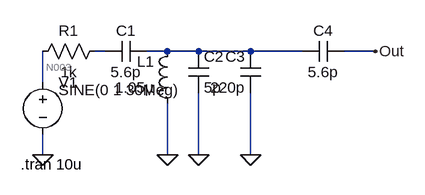
[diagram p0: schematic 10MHz Filter.asc]
10MHz Filter.asc, the LTspice schematic file:
Version 4
SHEET 1 880 680
WIRE 64 192 48 192
WIRE 160 192 128 192
WIRE 208 192 160 192
WIRE 288 192 208 192
WIRE 368 192 288 192
WIRE 480 192 432 192
WIRE -32 240 -32 192
WIRE -32 352 -32 320
WIRE 160 352 160 272
WIRE 208 352 208 256
WIRE 288 352 288 256
FLAG 480 192 Out
FLAG -32 352 0
FLAG 160 352 0
FLAG 208 352 0
FLAG 288 352 0
SYMBOL res 64 176 R90
WINDOW 0 0 56 VBottom 2
WINDOW 3 32 56 VTop 2
SYMATTR InstName R1
SYMATTR Value 1k
SYMBOL cap 128 176 R90
WINDOW 0 0 32 VBottom 2
WINDOW 3 32 32 VTop 2
SYMATTR InstName C1
SYMATTR Value 5.6p
SYMBOL cap 192 192 R0
SYMATTR InstName C2
SYMATTR Value 5p
SYMBOL cap 304 256 R180
WINDOW 0 24 56 Left 2
WINDOW 3 24 8 Left 2
SYMATTR InstName C3
SYMATTR Value 220p
SYMBOL ind 176 288 R180
WINDOW 0 36 80 Left 2
WINDOW 3 36 40 Left 2
SYMATTR InstName L1
SYMATTR Value 1.05µ
SYMBOL cap 432 176 R90
WINDOW 0 0 32 VBottom 2
WINDOW 3 32 32 VTop 2
SYMATTR InstName C4
SYMATTR Value 5.6p
SYMBOL voltage -32 224 R0
WINDOW 123 24 108 Left 2
WINDOW 39 0 0 Left 0
WINDOW 3 24 28 Left 2
SYMATTR InstName V1
SYMATTR Value SINE(0 1 30Meg)
TEXT -66 366 Left 2 !.tran 10u

The netlist it stands for:
* 10MHz Filter.asc
R1 N001 N003 1k
C1 N002 N001 5.6p
C2 N002 0 5p
C3 0 N002 220p
L1 0 N002 1.05µ
C4 Out N002 5.6p
V1 N003 0 SINE(0 1 30Meg)
.tran 10u
.backanno
.end

* Results of the author's LTspice run, read from the files saved beside the schematic
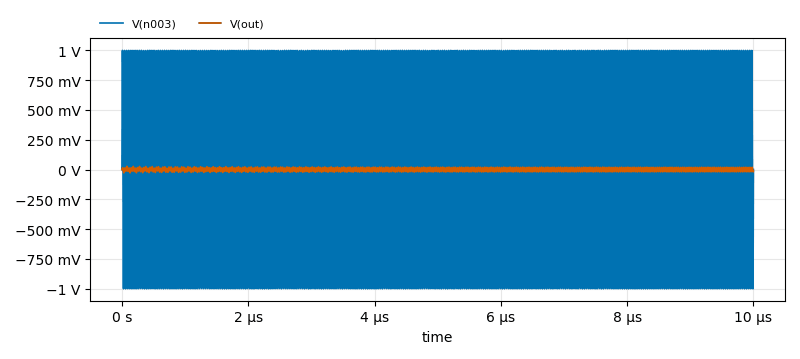
[diagram p1: Transient Analysis of 10MHz Filter.asc, plotted from the saved traces]
* Transient Analysis, 1 run:
*   V(n003): min -1 V, max 1 V, average 488.8 nV, rms 710 mV, last 0 V
*   V(out): min -27.28 mV, max 27.17 mV, average -6.705 µV, rms 13.51 mV, last -14.14 mV